# EAGLE schematic teensy robotica (EAGLE 9.4.0)
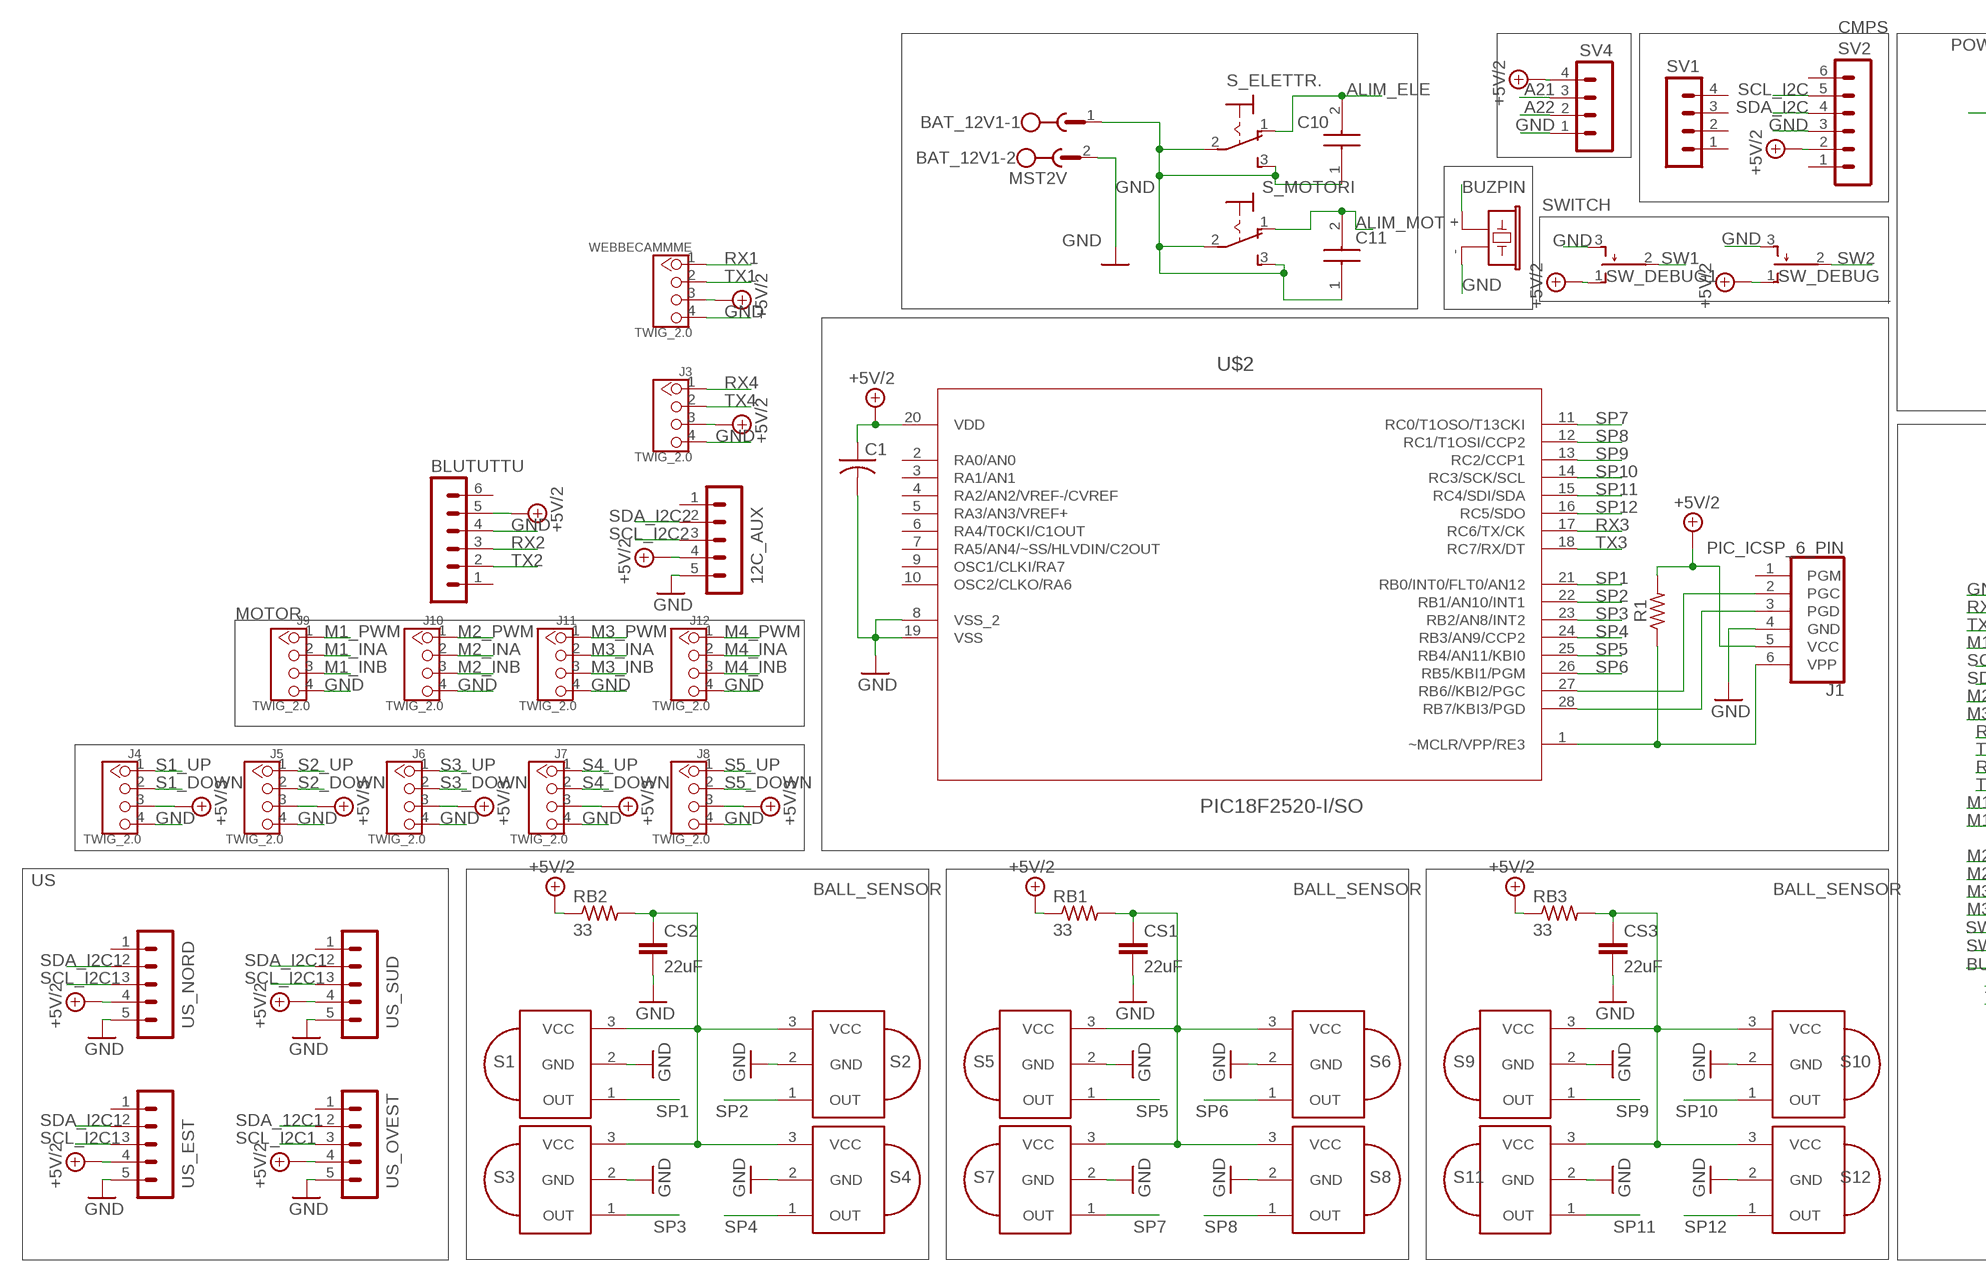
[diagram p0: schematic, sheet 1, part 1 of 2]
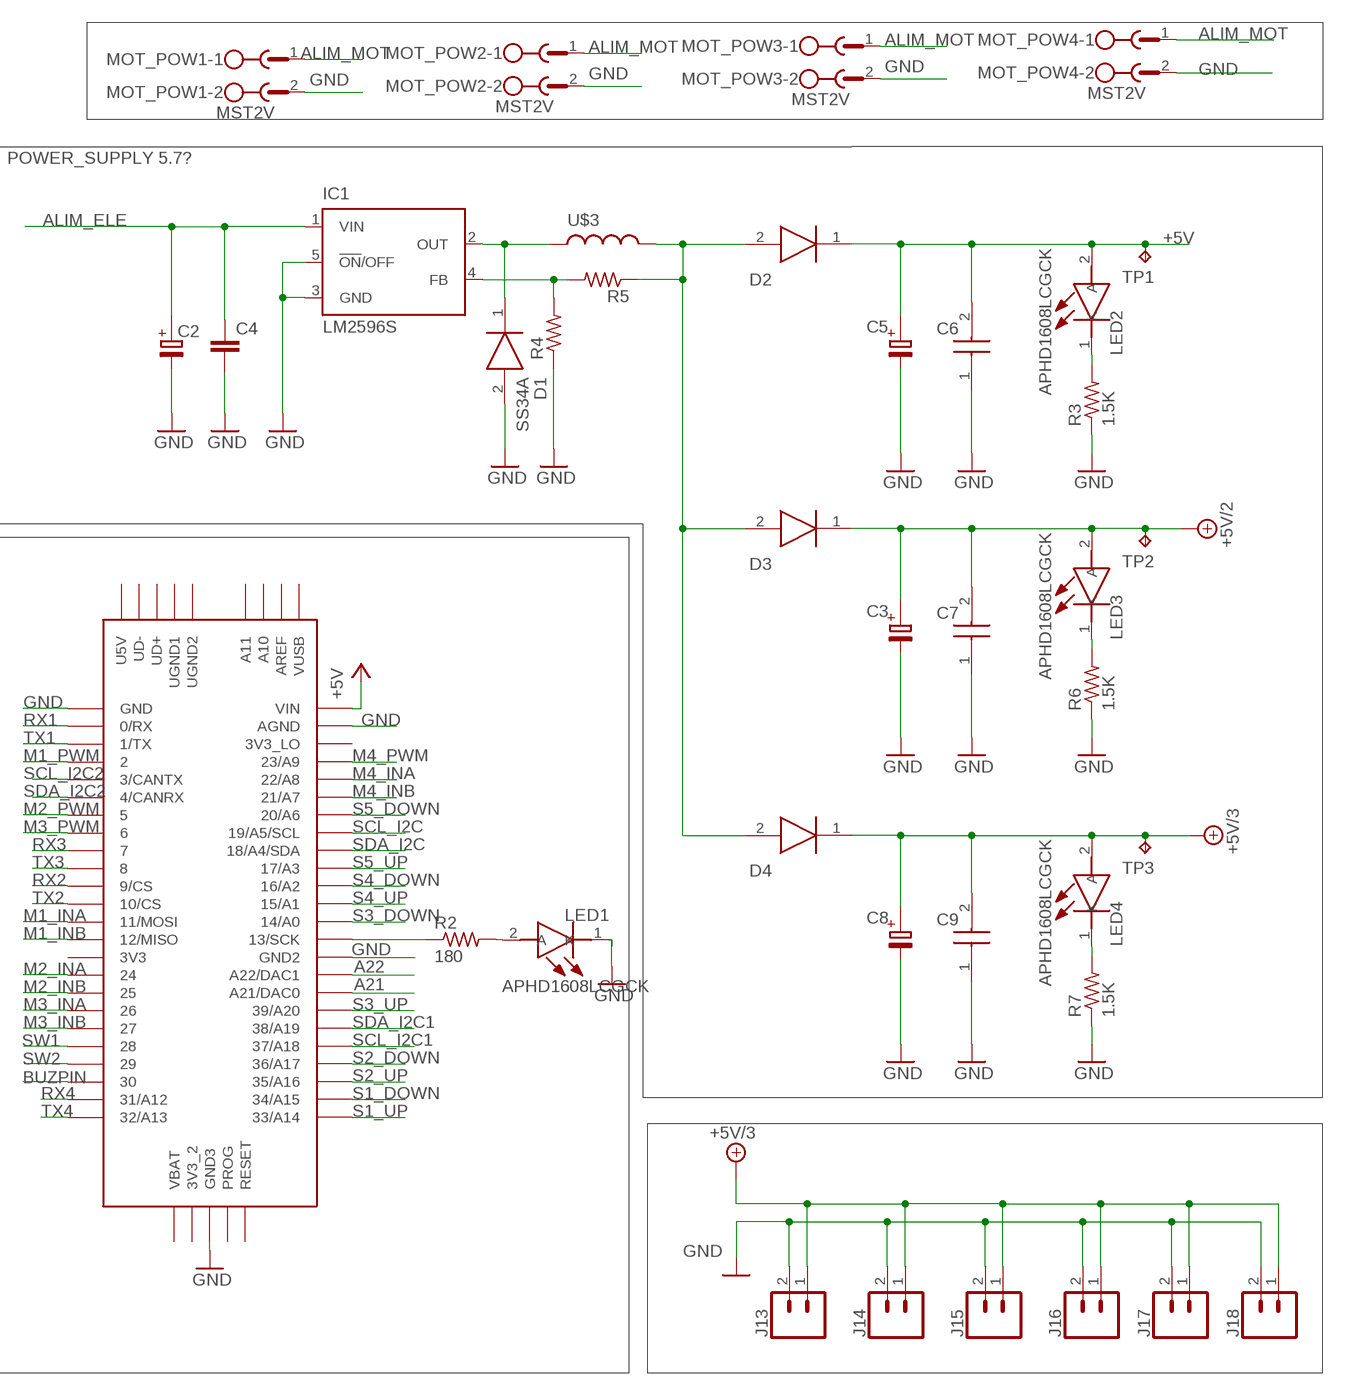
[diagram p1: schematic, sheet 1, part 2 of 2]

## Parts
12C_AUX  MA05-1  [MA05-1]
BAT_12V1  MST2V  [MSTBV2]
BLUTUTTU  MA06-1  [MA06-1]
C1  C-USC1206  [C1206]
C2  C-PR-SMD-SV-E/F  [SV-E/F]
C3  C-PR-SMD-SV-E/F  [SV-E/F]
C4  CC1206  [C1206]
C5  C-PR-SMD-SV-E/F  [SV-E/F]
C6  12065D106KAT2A  [CAPC3216X229N]
C7  12065D106KAT2A  [CAPC3216X229N]
C8  C-PR-SMD-SV-E/F  [SV-E/F]
C9  12065D106KAT2A  [CAPC3216X229N]
C10  12065D106KAT2A  [CAPC3216X229N]
C11  12065D106KAT2A  [CAPC3216X229N]
CS1  22uF  C-EUC1206  [C1206]
CS2  22uF  C-EUC1206  [C1206]
CS3  22uF  C-EUC1206  [C1206]
D1  SS34A  [DIOM5026X262N]
D2  SE20FG-M3_H  [SODFL3718X108N]
D3  SE20FG-M3_H  [SODFL3718X108N]
D4  SE20FG-M3_H  [SODFL3718X108N]
IC1  LM2596S  [TO263-5]
J1  PIC_ICSP_6_PIN  [MOLEX-1X6]
J3  TWIG_2.0  [2.0_1X4]
J4  TWIG_2.0  [2.0_1X4]
J5  TWIG_2.0  [2.0_1X4]
J6  TWIG_2.0  [2.0_1X4]
J7  TWIG_2.0  [2.0_1X4]
J8  TWIG_2.0  [2.0_1X4]
J9  TWIG_2.0  [2.0_1X4]
J10  TWIG_2.0  [2.0_1X4]
J11  TWIG_2.0  [2.0_1X4]
J12  TWIG_2.0  [2.0_1X4]
J13  CONN_02  [1X02]
J14  CONN_02  [1X02]
J15  CONN_02  [1X02]
J16  CONN_02  [1X02]
J17  CONN_02  [1X02]
J18  CONN_02  [1X02]
LED1  APHD1608LCGCK  [LEDM168X80N]
LED2  APHD1608LCGCK  [LEDM168X80N]
LED3  APHD1608LCGCK  [LEDM168X80N]
LED4  APHD1608LCGCK  [LEDM168X80N]
MOT_POW1  MST2V  [MSTBV2]
MOT_POW2  MST2V  [MSTBV2]
MOT_POW3  MST2V  [MSTBV2]
MOT_POW4  MST2V  [MSTBV2]
R1  10k  R-US_M1206  [M1206]
R2  180  R-US_M1206  [M1206]
R3  1.5K  R-US_R1206  [R1206]
R4  R-US_R1206  [R1206]
R5  R-US_R1206  [R1206]
R6  1.5K  R-US_R1206  [R1206]
R7  1.5K  R-US_R1206  [R1206]
RB1  33  R-US_M1206  [M1206]
RB2  33  R-US_M1206  [M1206]
RB3  33  R-US_M1206  [M1206]
S1  PNA460XM  [PNA460XM]
S2  PNA460XM  [PNA460XM]
S3  PNA460XM  [PNA460XM]
S4  PNA460XM  [PNA460XM]
S5  PNA460XM  [PNA460XM]
S6  PNA460XM  [PNA460XM]
S7  PNA460XM  [PNA460XM]
S8  PNA460XM  [PNA460XM]
S9  PNA460XM  [PNA460XM]
S10  PNA460XM  [PNA460XM]
S11  PNA460XM  [PNA460XM]
S12  PNA460XM  [PNA460XM]
S_ELETTR.  320-916  [320-916]
S_MOTORI  320-916  [320-916]
SG1  F/CM12P  [F/CM12P]
SV1  MA04-1  [MA04-1]
SV2  MA06-1  [MA06-1]
SV4  MA04-1  [MA04-1]
SW_DEBUG  TL38PO  [TL3XPO]
SW_DEBUG1  TL38PO  [TL3XPO]
TP1  TPTP13SQ  [TP13SQ]
TP2  TPTP13SQ  [TP13SQ]
TP3  TPTP13SQ  [TP13SQ]
U$1  TEENSY_3.5/3.6  [TEENSY_3.5/3.6]
U$2  PIC18F2520-I/SO  [SOIC127P1030X265-28N]
U$3  MSS1260  [MSS1260]
US_EST  MA05-1  [MA05-1]
US_NORD  MA05-1  [MA05-1]
US_OVEST  MA05-1  [MA05-1]
US_SUD  MA05-1  [MA05-1]
WEBBECAMMME  TWIG_2.0  [2.0_1X4]

## Nets
5.7V-DIRAMAZIONE2: D2.2(A) D3.2(A) D4.2(A) R5.1 U$3.P$1
+5V: C5.+ C6.2 D2.1(K) LED2.2(A) TP1.TP U$1.VIN
+5V/2: 12C_AUX.4 BLUTUTTU.5 C1.1 C3.+ C7.2 D3.1(K) J1.5(VCC) J3.3 LED3.2(A) R1.2 RB1.1 RB2.1 RB3.1 SV2.2 SV4.4 SW_DEBUG1.1(O) SW_DEBUG.1(O) TP2.TP U$2.20(VDD) US_EST.4 US_NORD.4 US_OVEST.4 US_SUD.4 WEBBECAMMME.3
+5V/3: C8.+ C9.2 D4.1(K) J4.3 J5.3 J6.3 J7.3 J8.3 J13.1 J14.1 J15.1 J16.1 J17.1 J18.1 LED4.2(A) TP3.TP
A21: SV4.3 U$1.21/DAC0(A21/DAC0)
A22: SV4.2 U$1.A22/DAC1
ALIM_ELE [Power]: C2.+ C4.1 C10.2 IC1.1(VIN) S_ELETTR..1(O)
ALIM_MOT [Power]: C11.2 MOT_POW1.1 MOT_POW2.1 MOT_POW3.1 MOT_POW4.1 S_MOTORI.1(O)
BUZPIN: SG1.+ U$1.30
GND [Power]: 12C_AUX.5 BAT_12V1.2 BLUTUTTU.4 C1.2 C2.- C3.- C4.2 C5.- C6.1 C7.1 C8.- C9.1 CS1.2 CS2.2 CS3.2 D1.2(A) IC1.3(GND) IC1.5(!ON!/OFF) J1.4(GND) J3.4 J4.4 J5.4 J6.4 J7.4 J8.4 J9.4 J10.4 J11.4 J12.4 J13.2 J14.2 J15.2 J16.2 J17.2 J18.2 LED1.1(K) MOT_POW1.2 MOT_POW2.2 MOT_POW3.2 MOT_POW4.2 R3.1 R4.1 R6.1 R7.1 S1.2(GND) S2.2(GND) S3.2(GND) S4.2(GND) S5.2(GND) S6.2(GND) S7.2(GND) S8.2(GND) S9.2(GND) S10.2(GND) S11.2(GND) S12.2(GND) SG1.- SV2.3 SV4.1 SW_DEBUG1.3(S) SW_DEBUG.3(S) U$1.AGND U$1.GND U$1.GND2 U$1.GND3 U$2.8(VSS_2) U$2.19(VSS) US_EST.5 US_NORD.5 US_OVEST.5 US_SUD.5 WEBBECAMMME.4
M1_INA: J9.2 U$1.11/MOSI
M1_INB: J9.3 U$1.12/MISO
M1_PWM: J9.1 U$1.2
M2_INA: J10.2 U$1.24
M2_INB: J10.3 U$1.25
M2_PWM: J10.1 U$1.5
M3_INA: J11.2 U$1.26
M3_INB: J11.3 U$1.27
M3_PWM: J11.1 U$1.6
M4_INA: J12.2 U$1.22/A8
M4_INB: J12.3 U$1.21/A7
M4_PWM: J12.1 U$1.23/A9
N$1: J1.6(VPP) R1.1 U$2.1(~MCLR/VPP/RE3)
N$2: J1.3(PGD) U$2.28(RB7/KBI3/PGD)
N$3: J1.2(PGC) U$2.27(RB6//KBI2/PGC)
N$4: R2.1 U$1.13/SCK
N$5: LED1.2(A) R2.2
N$6: D1.1(K) IC1.2(OUT) U$3.P$2
N$7: IC1.4(FB) R4.2 R5.2
N$8: LED2.1(K) R3.2
N$10: LED3.1(K) R6.2
N$12: LED4.1(K) R7.2
N$14: BAT_12V1.1 C10.1 C11.1 S_ELETTR..2(P) S_ELETTR..3(S) S_MOTORI.2(P) S_MOTORI.3(S)
POWER_BLOK_1: CS1.1 RB1.2 S5.3(VCC) S6.3(VCC) S7.3(VCC) S8.3(VCC)
POWER_BLOK_2: CS2.1 RB2.2 S1.3(VCC) S2.3(VCC) S3.3(VCC) S4.3(VCC)
POWER_BLOK_3: CS3.1 RB3.2 S9.3(VCC) S10.3(VCC) S11.3(VCC) S12.3(VCC)
RX1: U$1.0/RX WEBBECAMMME.1
RX2: BLUTUTTU.3 U$1.9/CS
RX3: U$1.7 U$2.17(RC6/TX/CK)
RX4: J3.1 U$1.31/A12
S1_DOWN: J4.2 U$1.34/A15
S1_UP: J4.1 U$1.33/A14
S2_DOWN: J5.2 U$1.36/A17
S2_UP: J5.1 U$1.35/A16
S3_DOWN: J6.2 U$1.14/A0
S3_UP: J6.1 U$1.39/A20
S4_DOWN: J7.2 U$1.16/A2
S4_UP: J7.1 U$1.15/A1
S5_DOWN: J8.2 U$1.20/A6
S5_UP: J8.1 U$1.17/A3
SCL_I2C: SV2.5 U$1.19/A5/SCL
SCL_I2C1: U$1.37/A18 US_EST.3 US_NORD.3 US_OVEST.3 US_SUD.3
SCL_I2C2: 12C_AUX.3 U$1.3/CANTX
SDA_12C1: US_OVEST.2
SDA_I2C: SV2.4 U$1.18/A4/SDA
SDA_I2C1: U$1.38/A19 US_EST.2 US_NORD.2 US_SUD.2
SDA_I2C2: 12C_AUX.2 U$1.4/CANRX
SP1: S1.1(OUT) U$2.21(RB0/INT0/FLT0/AN12)
SP2: S2.1(OUT) U$2.22(RB1/AN10/INT1)
SP3: S3.1(OUT) U$2.23(RB2/AN8/INT2)
SP4: S4.1(OUT) U$2.24(RB3/AN9/CCP2)
SP5: S5.1(OUT) U$2.25(RB4/AN11/KBI0)
SP6: S6.1(OUT) U$2.26(RB5/KBI1/PGM)
SP7: S7.1(OUT) U$2.11(RC0/T1OSO/T13CKI)
SP8: S8.1(OUT) U$2.12(RC1/T1OSI/CCP2)
SP9: S9.1(OUT) U$2.13(RC2/CCP1)
SP10: S10.1(OUT) U$2.14(RC3/SCK/SCL)
SP11: S11.1(OUT) U$2.15(RC4/SDI/SDA)
SP12: S12.1(OUT) U$2.16(RC5/SDO)
SW1: SW_DEBUG1.2(P) U$1.28
SW2: SW_DEBUG.2(P) U$1.29
TX1: U$1.1/TX WEBBECAMMME.2
TX2: BLUTUTTU.2 U$1.10/CS
TX3: U$1.8 U$2.18(RC7/RX/DT)
TX4: J3.2 U$1.32/A13
Unconnected: 12C_AUX.1 BLUTUTTU.1 BLUTUTTU.6 J1.1(PGM) SV1.1 SV1.2 SV1.3 SV1.4 SV2.1 SV2.6 U$1.3V3 U$1.3V3_2 U$1.3V3_LO U$1.A10 U$1.A11 U$1.AREF U$1.PROG U$1.RESET U$1.U5V U$1.UD+ U$1.UD- U$1.UGND1 U$1.UGND2 U$1.VBAT U$1.VUSB U$2.2(RA0/AN0) U$2.3(RA1/AN1) U$2.4(RA2/AN2/VREF-/CVREF) U$2.5(RA3/AN3/VREF+) U$2.6(RA4/T0CKI/C1OUT) U$2.7(RA5/AN4/~SS/HLVDIN/C2OUT) U$2.9(OSC1/CLKI/RA7) U$2.10(OSC2/CLKO/RA6) US_EST.1 US_NORD.1 US_OVEST.1 US_SUD.1

## Notes on the sheet
- CMPS
- POWER_SUPPLY 5.7?
- SWITCH
- MOTOR
- US
- BALL_SENSOR | BALL_SENSOR | BALL_SENSOR

## Library data of the parts
12C_AUX US_EST US_NORD US_OVEST US_SUD = con-lstb:MA05-1: PIN HEADER; OC_FARNELL: unknown; OC_NEWARK: unknown
BAT_12V1 MOT_POW1-MOT_POW4 = con-phoenix-508:MST2V: PHOENIX; OC_FARNELL: unknown; OC_NEWARK: unknown
BLUTUTTU SV2 = con-lstb:MA06-1: PIN HEADER; OC_FARNELL: unknown; OC_NEWARK: unknown
C1 = adafruit:C-US: CAPACITOR, American symbol
C2 C3 C5 C8 = cap-pan40:C-PR: POLARIZED ELECTROLYTIC/TANTALUM
C4 = eagle-ltspice:C: CAPACITOR, European symbol; SPICEMODEL: NONE; SPICEPREFIX: C
C6 C7 C9-C11 = 12065D106KAT2A:12065D106KAT2A: Multilayer Ceramic Capacitors MLCC - SMD/SMT 50V 10uF X5R 1206 10% HIGH CV Source: Datasheet <http://datasheets.avx.com/cx5r.pdf>; DESCRIPTION: Multilayer Ceramic Capacitors MLCC - SMD/SMT 50V 10uF X5R 1206 10% HIGH CV; HEIGHT: 2.29mm; MANUFACTURER_NAME: AVX; MANUFACTURER_PART_NUMBER: 12065D106KAT2A
CS1-CS3 = rcl:C-EU: CAPACITOR, European symbol
D1 = SamacSys_Parts:SS34A: HY Electronic Corp SS34A, SMT Rectifier Schottky Diode, 40V 3A, 2-Pin SMA Source: Datasheet <http://uk.rs-online.com/web/p/products/1711454>; DESCRIPTION: HY Electronic Corp SS34A, SMT Rectifier Schottky Diode, 40V 3A, 2-Pin SMA; HEIGHT: 2.62mm; MANUFACTURER_NAME: HY Electronic Corp; MANUFACTURER_PART_NUMBER: SS34A; RS_PART_NUMBER: 1711454
D2-D4 = SE20FG-M3_H:SE20FG-M3_H: Diode Rectifier 2A 400V Standard DO219AB Vishay SE20FG-M3/H, SMT Diode, 400V 2A, 920ns, 2-Pin DO-219AB Source: Datasheet <http://uk.rs-online.com/web/p/products/8949262P>; DESCRIPTION: Diode Rectifier 2A 400V Standard DO219AB Vishay SE20FG-M3/H, SMT Diode, 400V 2A, 920ns, 2-Pin DO-219AB; HEIGHT: 1.08mm; MANUFACTURER_NAME: Vishay; MANUFACTURER_PART_NUMBER: SE20FG-M3/H; RS_PART_NUMBER: 8949262P
IC1 = national-semiconductor:LM2596: SIMPLE SWITCHER® Power Converter 150 kHz 3A Step-Down Voltage Regulator Source: http://www.national.com/ds/LM/LM2596.pdf; MF: NATIONAL SEMICONDUCTOR; MPN: LM2596S-ADJ/NOPB; OC_FARNELL: 9494367; OC_NEWARK: 41K3842
J1 = SparkFun-Connectors:PIC_ICSP_6_PIN: ISCP Programming connector for PICs This 6 pin header contains all the lines necessary for programming most PIC microcontrollers. Here is the connector we sell at SparkFun: Polarized Connectors - Header (6-Pin) <https://www.sparkfun.com/products/8094> (PRT-08094) It is used on this SparkFun product: SparkFun UDB5 - PIC UAV Development Board <https://www.sparkfun.com/products/11703> (DEV-11703) Also, if you need a nice PIC programmer, please check these out: MPLAB PICkit 3 <https://www.sparkfun.com/products/9973> (PGM-09973); PROD_ID: CONN-08046; SF_ID: PRT-08094
J3-J12 WEBBECAMMME = CONNECTER:TWIG_2.0
J13-J18 = SparkFun-Connectors:CONN_02: Multi connection point. Often used as Generic Header-pin footprint for 0.1 inch spaced/style header connections On any of the 0.1 inch spaced packages, you can populate with these: Break Away Headers - Straight <https://www.sparkfun.com/products/116> (PRT-00116) Break Away Male Headers - Right Angle <https://www.sparkfun.com/products/553> (PRT-00553) Female Headers <https://www.sparkfun.com/products/115> (PRT-00115) Break Away Headers - Machine Pin <https://www.sparkfun.com/products/117> (PRT-00117) Break Away Female Headers - Swiss Machine Pin <https://www.sparkfun.com/products/743> (PRT-00743) For SCREWTERMINALS and SPRING TERMINALS visit here: Screw Terimnals on SparkFun.com <https://www.sparkfun.com/search/results?term=Screw+Terminals> (5mm/3.5mm/2.54mm spacing) This device is also useful as a general connection point to wire up your design to another part of your project. Our various solder wires solder well into these plated through hole pads. Hook-Up Wire - Assortment (Stranded, 22 AWG) <https://www.sparkfun.com/products/11375> (PRT-11375) Hook-Up Wire - Assortment (Solid Core, 22 AWG) <https://www.sparkfun.com/products/11367> (PRT-11367) View the entire wire category on our website here <https://www.sparkfun.com/categories/141> Special notes: Molex polarized connector foot print use with: PRT-08233 with associated crimp pins and housings. 2.54_SCREWTERM for use with PRT-10571. 3.5mm Screw Terminal footprints for PRT-08084 5mm Screw Terminal footprints for use with PRT-08432
LED1-LED4 = SamacSys_Parts:APHD1608LCGCK: Standard LEDs - SMD 0603 Dome Lens LED Green- 570nm Source: Datasheet <http://www.mouser.com/datasheet/2/216/APHD1608LCGCK-1100472.pdf>; DESCRIPTION: Standard LEDs - SMD 0603 Dome Lens LED Green- 570nm; HEIGHT: 0.8mm; MANUFACTURER_NAME: Kingbright; MANUFACTURER_PART_NUMBER: APHD1608LCGCK; MOUSER_PART_NUMBER: 604-APHD1608LCGCK
R1-R7 RB1-RB3 = adafruit:R-US_: RESISTOR, American symbol
S1-S12 = adafruit:PNA460XM: IR 38KHz receiver PNA4602 and related receivers http://www.ladyada.net/library/pcb/eaglelibrary.html
S_ELETTR. S_MOTORI = switch:320-916: TOGGLE SWITCH distributor RS Components
SG1 = buzzer:F/CM12P: BUZZER Source: Buerklin; OC_FARNELL: unknown; OC_NEWARK: unknown
SV1 SV4 = con-lstb:MA04-1: PIN HEADER; OC_FARNELL: unknown; OC_NEWARK: unknown
SW_DEBUG SW_DEBUG1 = switch:TL38PO: TINY SWITCH ON OFF MOM Source: http://www2.produktinfo.conrad.com/datenblaetter/700000-724999/705152-da-01-de-Subminiaturschalter_TL_36YO.pdf
TP1-TP3 = testpad:TP: Test pad
U$1 = Teensy356:TEENSY_3.5/3.6
U$2 = Microchip_By_element14_Batch_1:PIC18F2520-I/SO: Enhanced Flash Microcontroller; DESCRIPTION: Enhanced Flash Microcontroller; MPN: PIC18F2520-I/SO; OC_FARNELL: 9321241; OC_NEWARK: 89H0593; PACKAGE: SOIC-28; SUPPLIER: Microchip
U$3 = inductor-coilcraft:MSS1260: SMT Power Inductor

## Net classes
0 default: width 0.254 mm
1 Power: width 0.406 mm, clearance 0.61 mm
2 Power mot: width 1.93 mm